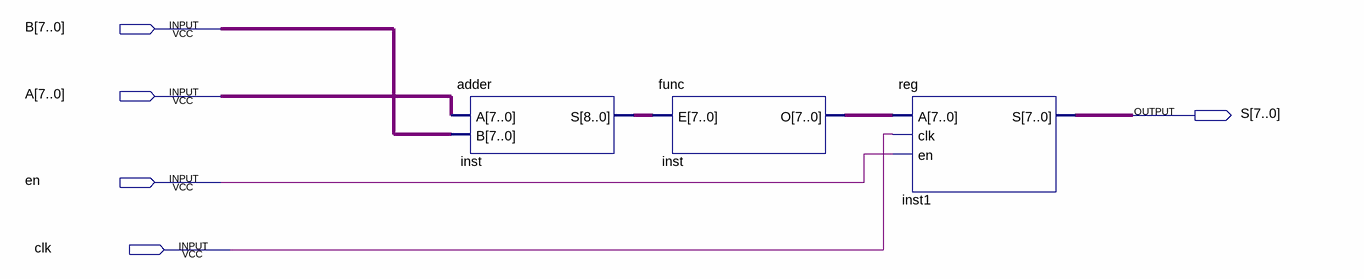
[diagram p0: schematic sheet]
// Quartus schematic neuronio.bdf as structural Verilog: 3 symbols, 5 pins
module neuronio (
  input  [7:0] B,
  input  [7:0] A,
  input  en,
  input  clk,
  output [7:0] S
);

  wire [7:0] inst_o;
  wire [8:0] inst_s;

  adder inst (.A(A), .B(B), .S(inst_s));
  func inst_dup2 (.E(inst_s), .O(inst_o));
  \reg  inst1 (.A(inst_o), .clk(clk), .en(en), .S(S));
endmodule
